# Altium schematic sheet MCU.SchDoc
size A4; SheetNumber: 3; SheetTotal: 3
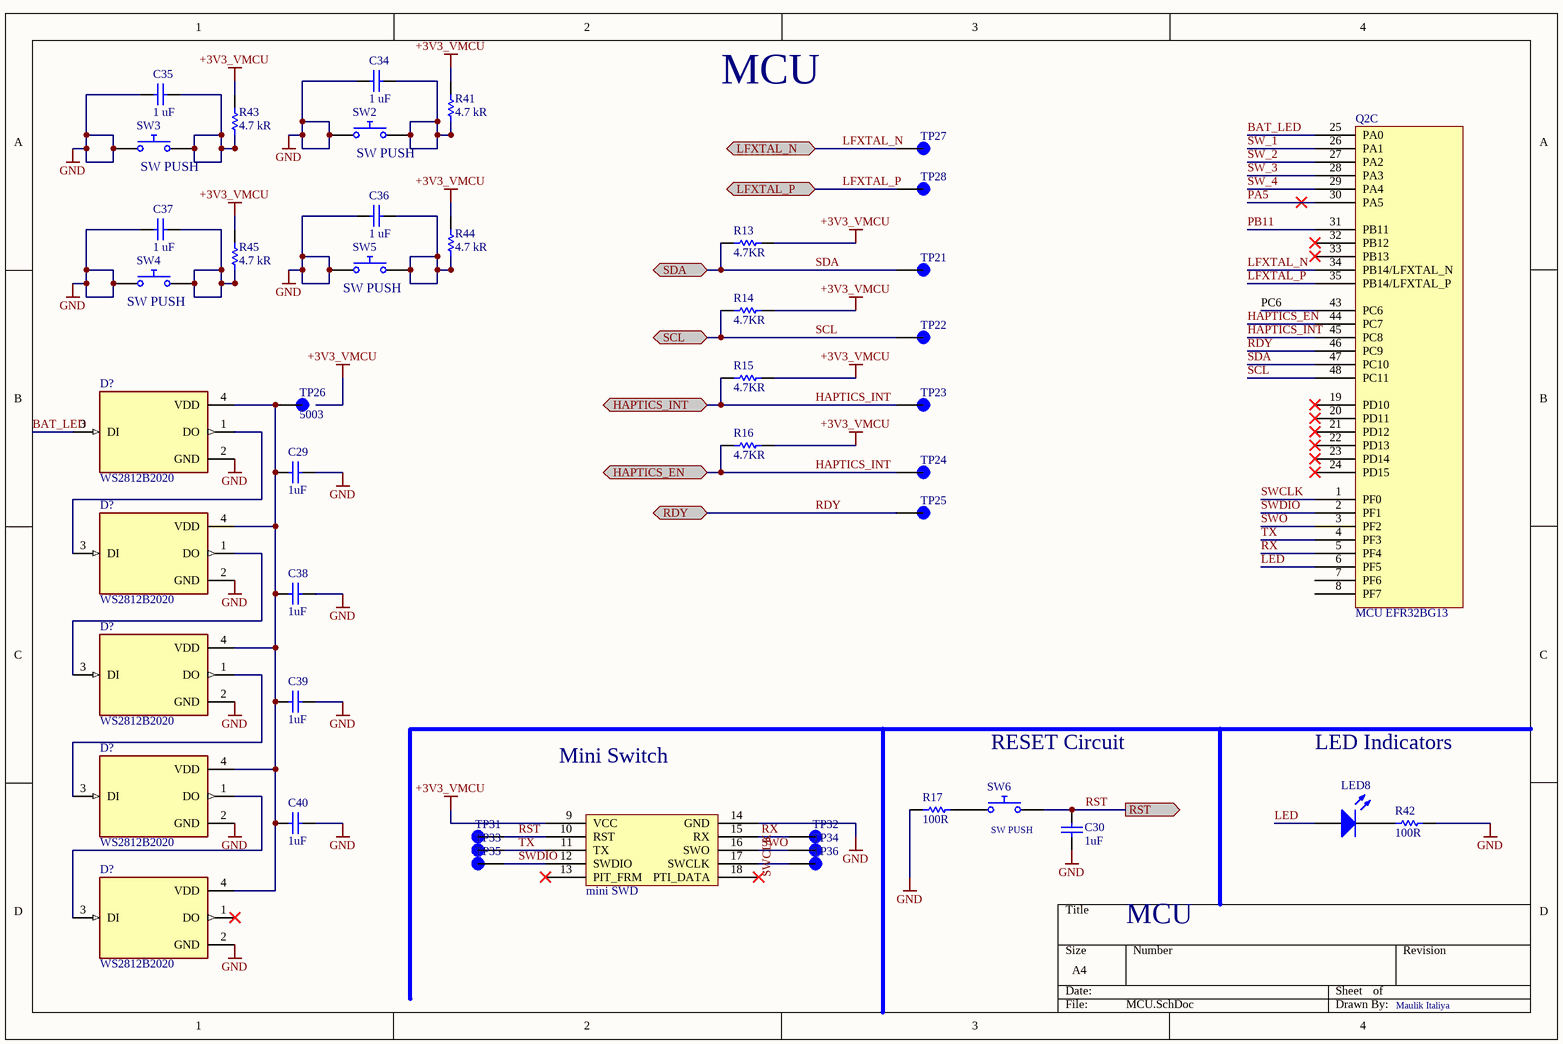
[diagram p0: MCU.SchDoc]

## Parts
(Parts that share a designator on the sheet are numbered #1, #2 ... from top to bottom, then left to right.)
?  mini SWD
C29  value 1uF  (hidden comment: Capacitor)
C30  value 1uF  (hidden comment: Capacitor)
C34  value 1 uF  (hidden comment: Capacitor)
C35  value 1 uF  (hidden comment: Capacitor)
C36  value 1 uF  (hidden comment: Capacitor)
C37  value 1 uF  (hidden comment: Capacitor)
C38  value 1uF  (hidden comment: Capacitor)
C39  value 1uF  (hidden comment: Capacitor)
C40  value 1uF  (hidden comment: Capacitor)
D?#1  WS2812B2020  [LED_WS2812B2020]
D?#2  WS2812B2020  [LED_WS2812B2020]
D?#3  WS2812B2020  [LED_WS2812B2020]
D?#4  WS2812B2020  [LED_WS2812B2020]
D?#5  WS2812B2020  [LED_WS2812B2020]
LED8  Light-Emitting Diode  (value not drawn)
Q2C  MCU EFR32BG13
R13  value 4.7KR  (hidden comment: Resistor)
R14  value 4.7KR  (hidden comment: Resistor)
R15  value 4.7KR  (hidden comment: Resistor)
R16  value 4.7KR  (hidden comment: Resistor)
R17  value 100R  (hidden comment: Resistor)
R41  value 4.7 kR  (hidden comment: Resistor)
R42  value 100R  (hidden comment: Resistor)
R43  value 4.7 kR  (hidden comment: Resistor)
R44  value 4.7 kR  (hidden comment: Resistor)
R45  value 4.7 kR  (hidden comment: Resistor)
SW2  Push Button Normally Opened  (value not drawn)
SW3  Push Button Normally Opened  (value not drawn)
SW4  Push Button Normally Opened  (value not drawn)
SW5  Push Button Normally Opened  (value not drawn)
SW6  Push Button Normally Opened  (value not drawn)
TP21  (no value)  [KEYSTONE_5003]
TP22  (no value)  [KEYSTONE_5003]
TP23  (no value)  [KEYSTONE_5003]
TP24  (no value)  [KEYSTONE_5003]
TP25  (no value)  [KEYSTONE_5003]
TP26  5003  [KEYSTONE_5003]
TP27  (no value)  [KEYSTONE_5003]
TP28  (no value)  [KEYSTONE_5003]
TP31  (no value)  [KEYSTONE_5003]
TP32  (no value)  [KEYSTONE_5003]
TP33  (no value)  [KEYSTONE_5003]
TP34  (no value)  [KEYSTONE_5003]
TP35  (no value)  [KEYSTONE_5003]
TP36  (no value)  [KEYSTONE_5003]

## Ports
HAPTICS_EN (bidir), HAPTICS_INT (bidir), LFXTAL_N (bidir, see Antenna & RF[4B]), LFXTAL_P (bidir, see Antenna & RF[4B]), RDY (bidir), RST (out, see Antenna & RF[2C]), SCL (bidir), SDA (bidir)

## Nets
+3V3_VMCU: ?.9(VCC) R13.2 R14.2 R15.2 R16.2 R41.2 R43.2 R44.2 R45.2
GND: ?.14(GND) C29.2 C30.1 C34.1 C35.1 C36.1 C37.1 C38.2 C39.2 C40.2 D?#1.2(GND) D?#2.2(GND) D?#3.2(GND) D?#4.2(GND) D?#5.2(GND) R17.1 R42.2 SW2.1 SW3.1 SW4.1 SW5.1
BAT_LED: D?#1.3(DI) Q2C.25(PA0)
HAPTICS_EN: Q2C.44(PC7)
HAPTICS_INT: Q2C.45(PC8) R15.1 R16.1 TP23.TP TP24.TP ; port HAPTICS_INT, port HAPTICS_EN
LED: LED8.1(A) Q2C.6(PF5)
LFXTAL_N: Q2C.34(PB14/LFXTAL_N) TP27.TP ; port LFXTAL_N
LFXTAL_P: Q2C.35(PB14/LFXTAL_P) TP28.TP ; port LFXTAL_P
PA5: Q2C.30(PA5)
PB11: Q2C.31(PB11)
PC6: Q2C.43(PC6)
RDY: Q2C.46(PC9) TP25.TP ; port RDY
RST: ?.10(RST) C30.2 SW6.2 TP31.TP ; port RST
RX: ?.15(RX) Q2C.5(PF4) TP32.TP
SCL: Q2C.48(PC11) R14.1 TP22.TP ; port SCL
SDA: Q2C.47(PC10) R13.1 TP21.TP ; port SDA
SW_1: Q2C.26(PA1)
SW_2: Q2C.27(PA2)
SW_3: Q2C.28(PA3)
SW_4: Q2C.29(PA4)
SWCLK: Q2C.1(PF0)
SWDIO: ?.12(SWDIO) Q2C.2(PF1) TP35.TP
SWO: ?.16(SWO) Q2C.3(PF2) TP34.TP
TX: ?.11(TX) Q2C.4(PF3) TP33.TP
Net?_17: ?.17(SWCLK) TP36.TP
NetC29_1: C29.1 C38.1 C39.1 C40.1 D?#1.4(VDD) D?#2.4(VDD) D?#3.4(VDD) D?#4.4(VDD) D?#5.4(VDD) TP26.TP
NetC34_2: C34.2 R41.1 SW2.2
NetC35_2: C35.2 R43.1 SW3.2
NetC36_2: C36.2 R44.1 SW5.2
NetC37_2: C37.2 R45.1 SW4.2
NetD?#1_1: D?#1.1(DO) D?#2.3(DI)
NetD?#2_1: D?#2.1(DO) D?#3.3(DI)
NetD?#3_1: D?#3.1(DO) D?#4.3(DI)
NetD?#4_1: D?#4.1(DO) D?#5.3(DI)
NetLED8_2: LED8.2(K) R42.1
NetR17_2: R17.2 SW6.1

Not connected (* = marked no-connect by the designer): ? 13(PIT_FRM)* 18(PTI_DATA)*; D?#5 1(DO)*; Q2C 7(PF6) 8(PF7) 19(PD10)* 20(PD11)* 21(PD12)* 22(PD13)* 23(PD14)* 24(PD15)* 32(PB12)* 33(PB13)*

## Notes on the sheet
- MCU
- (near SW3) SW PUSH
- (near SW2) SW PUSH
- (near SW4) SW PUSH
- (near SW5) SW PUSH
- Mini Switch
- RESET Circuit
- LED Indicators
- (near SW6) SW PUSH
- Maulik Italiya
- Labels drawn without touching a wire or pin: SWCLK

## Library data of the parts
C29 C30 C34-C40 = Capacitor: SimulationGenericComponent: True
D?#1-D?#5 = WS2812B2020: LED; SMD; 2020; RGB; 2x2x0.84mm; 3.7Ã·5.3V; Lens: transparent; 2kHz; MF: WorldSemi; SnapEDA_Link: https://www.snapeda.com/parts/WS2812B2020/Worldsemi/view-part/?ref=snap; Package: None; Value: *; MP: WS2812B2020; Check_prices: https://www.snapeda.com/parts/WS2812B2020/Worldsemi/view-part/?ref=eda
LED8 = LED: AF: 1; BV: 0; BV_MAX: 1e99; EG: 1.11; FC: 0.5; IBV: 0.001; IS: 1e-14; MJSW: 0.33; NTUN: 30; TNOM: 27; XTI: 3; SimulationGenericComponent: True; CJO: 0; CJP: 0; CTA: 0; CTP: 0; FCS: 0.5; FV_MAX: 1e99; IKF: 0; IKR: 0; ISR: 1e-14; JSW: 0; JTUN: 0; JTUNSW: 0; KEG: 1; KF: 0; LEVEL: 1; N: 1; NBV: 1; NR: 1; NS: 1; PHP: 1; RS: 0; TCV: 0; TLEV: 0; TLEVC: 0; TM1: 0; TM2: 0; TPB: 0; TPHP: 0; TRS: 0; TRS2: 0; TT: 0; TTT1: 0; TTT2: 0; VJ: 1; XTITUN: 3
Q2C = Q2C
R13-R17 R41-R45 = Resistor: TC1: 0; SimulationGenericComponent: True; TC2: 0
SW2-SW6 = Push Button NO: closed: 0; Rclosed: 1m; Ropen: 1Meg; SimulationGenericComponent: True
TP21-TP28 TP31-TP36 = 5003: Test Point Miniature THM H .300 Nylon 46 Insulated Orange PhosBronze/Silver | Keystone Electronics 5003; MF: Keystone Electronics Corp.; SnapEDA_Link: https://www.snapeda.com/parts/5003/Keystone/view-part/?ref=snap; Package: None; Value: *; MP: 5003; Check_prices: https://www.snapeda.com/parts/5003/Keystone/view-part/?ref=eda